# Altium project LUMOS.PrjPcb
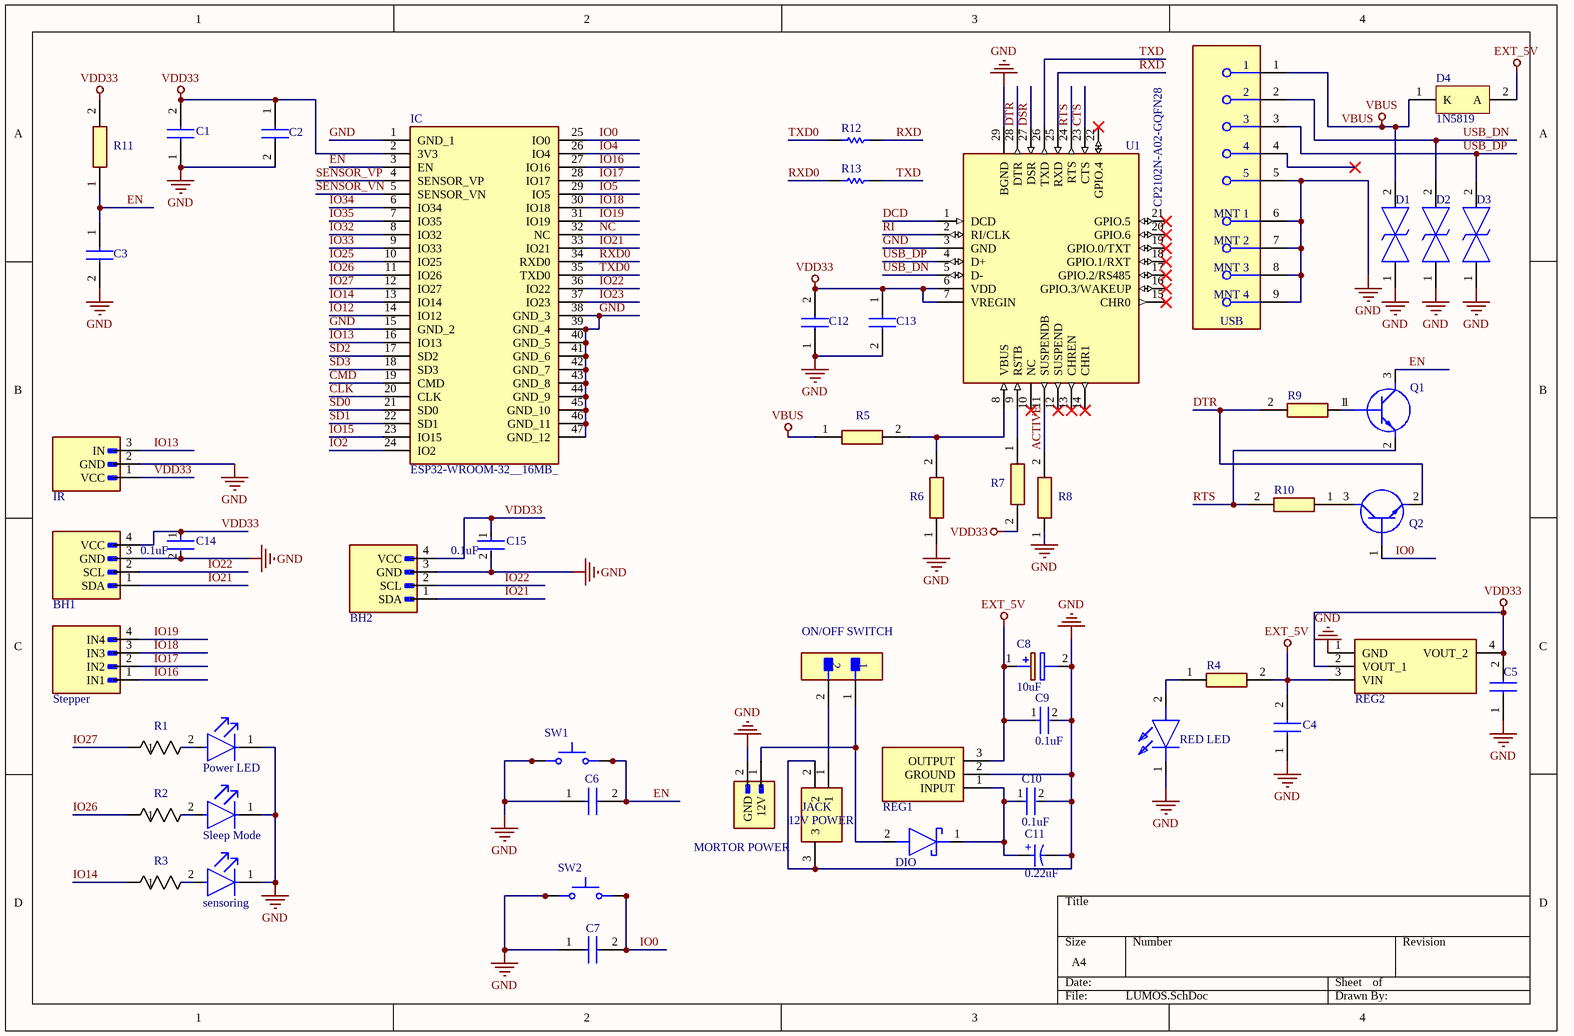
[diagram p0: LUMOS.SchDoc]
1 sheet, 53 parts. Net scope: global (net labels, ports and power ports of the same name join across sheets).
Board file: LUMOS.PcbDoc

## Sheet LUMOS.SchDoc
size A4; SheetNumber: 1; SheetTotal: 1

### Parts
12V_POWER  JACK  [PJ-102AH]
BH1  M20-9990446  [HARWIN_M20-9990446]  (value not drawn)
BH2  M20-9990446  [HARWIN_M20-9990446]  (value not drawn)
C1  22uF/10V(20%)  [FK20]  (value not drawn)
C2  0.1uF/50V(10%)  [C320C104K5R5TA]  (value not drawn)
C3  0.1uF/50V(10%)  [C320C104K5R5TA]  (value not drawn)
C4  22uF/10V(20%)  [FK20]  (value not drawn)
C5  22uF/10V(20%)  [FK20]  (value not drawn)
C6  0.1uF/50V(10%)  [C320C104K5R5TA]  (value not drawn)
C7  0.1uF/50V(10%)  [C320C104K5R5TA]  (value not drawn)
C8  10uF  [CAPPRD200W55D500H1250]
C9  0.1uF  [FP-RDE0P1-MFG]
C10  0.1uF  [FP-RDE0P1-MFG]
C11  0.22uF  [WCAP-ATG8_D5H11]
C12  10uF/10v(20%)  [FK24]  (value not drawn)
C13  0.1uF/50V(10%)  [C320C104K5R5TA]  (value not drawn)
C14  0.1uF  [FP-RDE0P1-MFG]
C15  0.1uF  [FP-RDE0P1-MFG]
D1  LESD5D5.0CT1G  [LESD5D50CT1G]  (value not drawn)
D2  LESD5D5.0CT1G  [LESD5D50CT1G]  (value not drawn)
D3  LESD5D5.0CT1G  [LESD5D50CT1G]  (value not drawn)
D4  1N5819  [ONSC-AXIAL_LEAD-2-59-10_P]
D5  Power LED  [FP-HLMP-1301-MFG]
D6  Sleep Mode  [FP-HLMP-1301-MFG]
D7  sensoring  [FP-HLMP-1301-MFG]
DIO  SD103A-TR  [DIOAD950W60L350D150]  (value not drawn)
IC  ESP32-WROOM-32__16MB_  [ESP32WROOM3216MB]
IR  M20-9990346  [HARWIN_M20-9990346]  (value not drawn)
MORTOR_POWER  M20-9990246  [HARWIN_M20-9990246]  (value not drawn)
ON/OFF_SWITCH  M20-9990246  [FP-M20-9990246-MFG]  (value not drawn)
Q1  SS8050-G  [SOT95P240X115-3N]  (value not drawn)
Q2  SS8050-G  [SOT95P240X115-3N]  (value not drawn)
R1  330ohm  [RES_AC05_VIS]  (value not drawn)
R2  330ohm  [RES_AC05_VIS]  (value not drawn)
R3  330ohm  [RES_AC05_VIS]  (value not drawn)
R4  2k(5%)  [RESAD1590W60L630D240]  (value not drawn)
R5  22.1K(1%)  [RESAD1590W60L630D240]  (value not drawn)
R6  47.5K(1%)  [RESAD1590W60L630D240]  (value not drawn)
R7  2k(5%)  [RESAD1590W60L630D240]  (value not drawn)
R8  10k(5%)(NC)  [RESAD1590W60L630D240]  (value not drawn)
R9  10k(5%)  [RESAD1590W60L630D240]  (value not drawn)
R10  10k(5%)  [RESAD1590W60L630D240]  (value not drawn)
R11  10k(5%)  [RESAD1590W60L630D240]  (value not drawn)
R12  0r(5%)  [RESC2013X60X35ML10T20]  (value not drawn)
R13  0r(5%)  [RESC2013X60X35ML10T20]  (value not drawn)
RED_LED  151031SS06000  [151034GS03000]  (value not drawn)
REG1  L7805CV  [TO255P460X1020X2008-3P]  (value not drawn)
REG2  AMS1117-3.3  [SOT229P700X180-4N]  (value not drawn)
Stepper  M20-9990446  [HARWIN_M20-9990446]  (value not drawn)
SW1  222ADVBA  [SW_222ADVBA]  (value not drawn)
SW2  222ADVBA  [SW_222ADVBA]  (value not drawn)
U1  CP2102N-A02-GQFN28  [QFN50P500X500X80-29N-D]
USB  47642-0001  [FP-47642-0001-MFG]  (value not drawn)

### Nets
EXT_5V: C4.2 C8.1(+) C9.1 D4.2(A) R4.2 REG1.3(OUTPUT) REG2.3(VIN)
GND: 12V_POWER.2 12V_POWER.3 BH1.3(GND) BH2.3(GND) C1.1 C2.2 C3.2 C4.1 C5.1 C6.1 C7.1 C8.2(-) C9.2 C10.2 C11.2(N) C12.1 C13.2 C14.2 C15.2 D1.1 D2.1 D3.1 D5.1(C) D6.1(C) D7.1(C) IC.1(GND_1) IC.15(GND_2) IC.38(GND_3) IC.39(GND_4) IC.40(GND_5) IC.41(GND_6) IC.42(GND_7) IC.43(GND_8) IC.44(GND_9) IC.45(GND_10) IC.46(GND_11) IC.47(GND_12) IR.2(GND) MORTOR_POWER.2(GND) R6.1 R8.1 RED_LED.1(K) REG1.2(GROUND) REG2.1(GND) SW1.1 SW1.3 SW2.1 SW2.3 U1.3(GND) U1.29(BGND) USB.5 USB.6(MNT_1) USB.7(MNT_2) USB.8(MNT_3) USB.9(MNT_4)
VBUS: D1.2 D4.1(K) R5.1 USB.1
VDD33: BH1.4(VCC) BH2.4(VCC) C1.2 C2.1 C5.2 C12.2 C13.1 C14.1 C15.1 IC.2(3V3) IR.1(VCC) R7.2 R11.2 REG2.2(VOUT_1) REG2.4(VOUT_2) U1.6(VDD) U1.7(VREGIN)
ACTIVE: R8.2 U1.11(SUSPENDB)
CLK: IC.20(CLK)
CMD: IC.19(CMD)
CTS: U1.23(CTS)
DCD: U1.1(DCD)
DSR: U1.27(DSR)
DTR: Q2.2(E) R9.2 U1.28(DTR)
EN: C3.1 C6.2 IC.3(EN) Q1.3(C) R11.1 SW1.2 SW1.4
IO0: C7.2 IC.25(IO0) Q2.1(B) SW2.2 SW2.4
IO2: IC.24(IO2)
IO4: IC.26(IO4)
IO5: IC.29(IO5)
IO12: IC.14(IO12)
IO13: IC.16(IO13) IR.3(IN)
IO14: IC.13(IO14) R3.1
IO15: IC.23(IO15)
IO16: IC.27(IO16) Stepper.1(IN1)
IO17: IC.28(IO17) Stepper.2(IN2)
IO18: IC.30(IO18) Stepper.3(IN3)
IO19: IC.31(IO19) Stepper.4(IN4)
IO21: BH1.1(SDA) BH2.1(SDA) IC.33(IO21)
IO22: BH1.2(SCL) BH2.2(SCL) IC.36(IO22)
IO23: IC.37(IO23)
IO25: IC.10(IO25)
IO26: IC.11(IO26) R2.1
IO27: IC.12(IO27) R1.1
IO32: IC.8(IO32)
IO33: IC.9(IO33)
IO34: IC.6(IO34)
IO35: IC.7(IO35)
NC: IC.32(NC)
RI: U1.2(RI/CLK)
RTS: Q1.2(E) R10.2 U1.24(RTS)
RXD: R12.2 U1.25(RXD)
RXD0: IC.34(RXD0) R13.1
SD0: IC.21(SD0)
SD1: IC.22(SD1)
SD2: IC.17(SD2)
SD3: IC.18(SD3)
SENSOR_VN: IC.5(SENSOR_VN)
SENSOR_VP: IC.4(SENSOR_VP)
TXD: R13.2 U1.26(TXD)
TXD0: IC.35(TXD0) R12.1
USB_DN: D2.2 U1.5(D-) USB.2
USB_DP: D3.2 U1.4(D+) USB.3
Net12V_POWER_1: 12V_POWER.1 ON/OFF_SWITCH.2
NetC10_1: C10.1 C11.1(P) DIO.1(K) REG1.1(INPUT)
NetD5_2: D5.2(A) R1.2
NetD6_2: D6.2(A) R2.2
NetD7_2: D7.2(A) R3.2
NetDIO_2: DIO.2(A) MORTOR_POWER.1(12V) ON/OFF_SWITCH.1
NetQ1_1: Q1.1(B) R9.1
NetQ2_3: Q2.3(C) R10.1
NetR4_1: R4.1 RED_LED.2(A)
NetR5_2: R5.2 R6.2 U1.8(VBUS)
NetR7_1: R7.1 U1.9(RSTB)

Not connected (* = marked no-connect by the designer): U1 10(NC)* 12(SUSPEND)* 13(CHREN)* 14(CHR1)* 15(CHR0)* 16(GPIO.3/WAKEUP)* 17(GPIO.2/RS485)* 18(GPIO.1/RXT)* 19(GPIO.0/TXT)* 20(GPIO.6)* 21(GPIO.5)* 22(GPIO.4)*; USB 4*

### Notes on the sheet
- (in symbol CMP-03913-54007281-1) +

### Library data of the parts
12V_POWER = PJ-102A: Connector; Manufacturer_Name: Same Sky; Datasheet Link: https://www.sameskydevices.com/product/resource/supplyframepdf/pj-102a.pdf; Manufacturer_Part_Number: PJ-102A; Mouser Part Number: 490-PJ-102A; Mouser Price/Stock: https://www.mouser.co.uk/ProductDetail/Same-Sky/PJ-102A?qs=WyjlAZoYn50UKjtnxOz%252Bqg%3D%3D; Arrow Part Number: PJ-102A; Arrow Price/Stock: https://www.arrow.com/en/products/pj-102a/cui-devices?utm_currency=USD&region=nac
BH1 BH2 Stepper = M20-9990446: MF: Harwin; Package: None; Price: None; Value: *; MP: M20-9990446; Availability: Unavailable
C1 C4 C5 = FK20X7R1A226MR000: Capacitor; Manufacturer_Name: TDK; Datasheet Link: https://product.tdk.com/system/files/dam/doc/product/capacitor/ceramic/lead-mlcc/catalog/leadmlcc_conventional_fk_en.pdf; Height: 7mm; Manufacturer_Part_Number: FK20X7R1A226MR000; Mouser Part Number: N/A; Mouser Price/Stock: https://www.mouser.co.uk/ProductDetail/TDK/FK20X7R1A226MR000?qs=Ii670aiJhr4gDy7w7zqgKQ%3D%3D
C2 C3 C6 C7 C13 = C320C104K5R5TA: Capacitor; Manufacturer_Name: KEMET; Datasheet Link: https://content.kemet.com/datasheets/KEM_C1050_GOLDMAX_X7R.pdf; Height: 5.84mm; Manufacturer_Part_Number: C320C104K5R5TA; Mouser Part Number: 80-C320C104K5R; Mouser Price/Stock: https://www.mouser.co.uk/ProductDetail/KEMET/C320C104K5R5TA?qs=PmkNt%2FFLxQc4kNUCHU6a6Q%3D%3D; Arrow Part Number: C320C104K5R5TA; Arrow Price/Stock: https://www.arrow.com/en/products/c320c104k5r5ta/kemet-corporation?utm_currency=USD&region=nac
C8 = EEU-FR1H100: Capacitor Polarised,EEU-FR1H100; Manufacturer_Name: Panasonic; Datasheet Link: http://industrial.panasonic.com/cdbs/www-data/pdf/RDF0000/ABA0000C1259.pdf; Height: 12.5mm; Manufacturer_Part_Number: EEU-FR1H100; Mouser Part Number: 667-EEU-FR1H100; Mouser Price/Stock: https://www.mouser.co.uk/ProductDetail/Panasonic/EEU-FR1H100?qs=tfZGHB2PWd1NAbdNSgjToQ%3D%3D
C9 C10 C14 C15 = CMP-06035-036375-1: Ceramic Capacitor 100nF ±10% 25V X7R Radial,RDER71E104K0P1H03B; Lead Diameter: 0.5mm; Mount: Through Hole; Resistor Type: Ceramic; Case/Package: Radial; Height - Seated (Max): 0.236inch; Lead Pitch: 0.098inch; Lead Free: Lead Free; Voltage Rating (DC): 25V; Width: 0.098inch; Packaging: Bulk; Dielectric: X7R; Tolerance: 10%; Min Operating Temperature: -55°C; Capacitance: 100nF; Max Operating Temperature: 125°C; Termination: Radial; Height: 3.5mm; Package Quantity: 500; Voltage Rating: 25V; Length: 0.197inch; Value: 100nF
C11 = CMP-03913-54007281-1: 860010772002 WCAP-ATG8 Aluminum Electrolytic Capacitors; Polarity: Polar; Voltage Rating: 63V; Dissipation Factor: 9%; Tolerance: 20%; Capacitance: 220nF; Leakage Current: 3µA; Pitch: 2mm; Life (Hours): 2000hours; Ripple Current: 4mA; Value: 220nF; Diameter: 5mm; NexarPartId: 54007281; RoHS: Compliant; Lead Pitch: 2.0066mm; Min Operating Temperature: -40°C; Max Operating Temperature: 85°C; Case/Package: Radial; Height - Seated (Max): 12.4968mm; Mount: Through Hole; Height: 11mm; REACH SVHC: Unknown; Voltage Rating (DC): 63V; Length: 11mm; Packaging: Tape & Box (TB)
C12 = FK24X5R1A106KR000: Capacitor; Manufacturer_Name: TDK; Datasheet Link: https://product.tdk.com/system/files/dam/doc/product/capacitor/ceramic/lead-mlcc/catalog/leadmlcc_conventional_fk_en.pdf; Height: 5.5mm; Manufacturer_Part_Number: FK24X5R1A106KR000
D1-D3 = LESD5D5.0CT1G: TVS Diode (Bi-directional); Manufacturer_Name: LRC; Height: 0.7mm; Manufacturer_Part_Number: LESD5D5.0CT1G
D4 = CMP-1055-00042-1: Rectifier, 2-Pin Axial_Lead, Pb-Free, Bulk Bag; Manufacturer: On Semiconductor; IFSM Max (A): 25; Configuration: Single; Note1: 0; PackageDescription: 2-Pin, Axial Lead, Diameter 2.35 mm; Mounting Technology: Through Hole; Packing: Bulk Bag; RoHS: TRUE; DatasheetVersion: Rev. 10; ComponentLink3Description: Package Specification; ComponentLink1URL: http://www.onsemi.com/; ComponentLink2Description: Datasheet; PackageReference: AXIAL_LEAD-2-59-10; ComponentLink3URL: http://www.onsemi.cn/pub_link/Collateral/59-10.PDF; PackageVersion: Rev. U, 02/2005; PartNumber: 1N5819; ComponentLink1Description: Manufacturer URL; ComponentLink2URL: http://www.onsemi.cn/pub_link/Collateral/1N5817-D.PDF
D5-D7 = CMP-18399-000007-1: LED RED DIFFUSED T-1 T/H; Manufacturer: Broadcom; Forward Current: 10mA; Max Junction Temp: +110°C; Wavelength: 626nm; Led Orientation: Straight; Viewing Angle: 60°; Luminous Intensity: 3.4mcd; Forward Voltage: 1.9V; Reverse Voltage: 5V; Peak Emmision Wavelength: 635nm; Mouser Description: Standard LEDs - Through Hole Red Diffused 635nm 3.4mcd; RoHS: TRUE; ComponentLink2Description: Datasheet; Device Class L1: Optoelectronics; Temperature Range High: +100°C; Manufacturer Part Number: HLMP-1301; ComponentLink2URL: https://docs.broadcom.com/docs/AV02-1555EN; Colour: Red; Digikey Description: LED RED DIFFUSED T-1 T/H; Automotive: No; Device Class L2: LEDs; Temperature Range Low: -40°C; Octopart: https://octopart.com/hlmp-1301-broadcom-71130345; Category: Diode; Lead Free: Yes; Device Class L3: unset; Package: 0; Temperature: -40°C to +100°C
DIO = SD103A-TR: Schottky Diode; Manufacturer_Name: Vishay; Datasheet Link: https://componentsearchengine.com/Datasheets/5/SD103A-TR.pdf; Manufacturer_Part_Number: SD103A-TR; Mouser Part Number: 625-SD103A; Mouser Price/Stock: https://www.mouser.co.uk/ProductDetail/Vishay-Semiconductors/SD103A-TR?qs=RwahMLkpD2urFD%2FzZdGOBw%3D%3D; Arrow Part Number: SD103A-TR; Arrow Price/Stock: https://www.arrow.com/en/products/sd103a-tr/vishay?utm_currency=USD&region=nac
IC = ESP32-WROOM-32__16MB_: Integrated Circuit; Manufacturer_Name: Espressif Systems; Manufacturer_Part_Number: ESP32-WROOM-32 (16MB); Datasheet Link: https://www.espressif.com/sites/default/files/documentation/esp32_datasheet_en.pdf; Height: 3.2mm; Mouser Part Number: 356-ESPWROOM3216MB; Mouser Price/Stock: https://www.mouser.co.uk/ProductDetail/Espressif-Systems/ESP32-WROOM-32-16MB?qs=w%2Fv1CP2dgqrcPyEPuQvO1A%3D%3D
IR = M20-9990346: 2.54mm (0.1) Pitch SIL Vertical Throughboard Pin Header, 6.1mm mating pin height, tin, 3 contacts; MF: Harwin; SnapEDA_Link: https://www.snapeda.com/parts/M20-9990346/Harwin/view-part/?ref=snap; Package: None; Value: *; MP: M20-9990346; Check_prices: https://www.snapeda.com/parts/M20-9990346/Harwin/view-part/?ref=eda
MORTOR_POWER = M20-9990246: 2.54mm (0.1) Pitch SIL Vertical Throughboard Pin Header, 6.1mm mating pin height, tin, 2 contacts; MF: Harwin; SnapEDA_Link: https://www.snapeda.com/parts/M20-9990246/Harwin/view-part/?ref=snap; Package: None; Value: *; MP: M20-9990246; Check_prices: https://www.snapeda.com/parts/M20-9990246/Harwin/view-part/?ref=eda
ON/OFF_SWITCH = CMP-15831-000009-1: CONN HEADER VERT 2POS 2.54MM; Manufacturer: Harwin; Conn Gender: Male; Conn Orientation: Vertical; Number Of Contacts: 2; Current Rating: 3A; ComponentLink2URL: https://cdn.harwin.com/pdfs/M20-999.pdf; ComponentLink2Description: Datasheet; Package: M20-9990246; Temperature: -40°C to +105°C; Octopart: https://octopart.com/m20-9990246-harwin-2590635; Mouser Description: 2.54mm (0.1") Pitch SIL Vertical PC Tail Pin Header, 6.1mm mating pin height, tin, 2 contacts; Temperature Range High: +105°C; Device Class L1: Connectors; RoHS: TRUE; Automotive: No; Height: 8.99mm; Number Of Rows: 1; Contact Material: Tin,Nickel; Category: Conn; Pitch: 2.54mm; Lead Free: Yes; Digikey Description: CONN HEADER VERT 2POS 2.54MM; Manufacturer Part Number: M20-9990246; Temperature Range Low: -40°C; Device Class L3: unset; Device Class L2: Headers and Wire Housings
Q1 Q2 = SS8050-G: Transistor BJT NPN; Manufacturer_Name: Comchip Technology; Datasheet Link: https://datasheet.datasheetarchive.com/originals/distributors/DKDS-12/229454.pdf; Height: 1.15mm; Manufacturer_Part_Number: SS8050-G; Mouser Part Number: 750-SS8050-G; Mouser Price/Stock: https://www.mouser.co.uk/ProductDetail/Comchip-Technology/SS8050-G?qs=LLUE9lz1YbcHg%252BWLMAtcrQ%3D%3D; Arrow Part Number: SS8050-G; Arrow Price/Stock: https://www.arrow.com/en/products/ss8050-g/comchip-technology?region=nac
R1-R3 = CMP-00030-39745953-1: AC05000003300JAC00 VISHAY AC05000003300JAC00 Through Hole Resistor, 330 ohm, Axial Leaded, 5 W, 5%, AC Series; Temperature Coefficient: -10ppm/°C; Resistance: 330Ω; Voltage Rating (DC): 40V; Lead Diameter: 800µm; Power Rating: 5W; Value: 330Ω; Lead Free: Lead Free; NexarPartId: 39745953; REACH SVHC: Unknown; Max Operating Temperature: 275°C; Composition: Wirewound; Diameter: 7.5mm; Features: Flame Retardant Coating; Military Standard: Not; Tolerance: 5%; Packaging: Cut Tape (CT); Width: 7.49mm; Number of Terminations: 2; Contact Plating: Tin; Termination: Axial; RoHS: Compliant; Radiation Hardening: No; Min Operating Temperature: -40°C; Length: 18mm; Number of Pins: 2; Max Power Dissipation: 5W; Case/Package: Axial; Schedule B: 8533210080, 8533210080
R4 R7 = CFR-25JB-52-2K2: Resistor; Manufacturer_Name: YAGEO; Datasheet Link: https://www.mouser.in/datasheet/2/447/YAGEO_CFR_datasheet_2021v0-3002993.pdf; Manufacturer_Part_Number: CFR-25JB-52-2K2; Mouser Part Number: 603-CFR-25JB-52-2K2; Mouser Price/Stock: https://www.mouser.co.uk/ProductDetail/YAGEO/CFR-25JB-52-2K2?qs=oypCK0zG327VTyS4ZTRfWw%3D%3D
R5 = MFR-25FRF52-22K1: Resistor; Manufacturer_Name: KEMET; Datasheet Link: https://www.yageo.com/upload/media/product/productsearch/datasheet/lr/YAGEO%20MFR_datasheet_2021v1.pdf; Manufacturer_Part_Number: MFR-25FRF52-22K1; Mouser Part Number: 603-MFR-25FRF5222K1; Mouser Price/Stock: https://www.mouser.co.uk/ProductDetail/YAGEO/MFR-25FRF52-22K1?qs=5furm%2FeQHzR7C102KsI%252BDQ%3D%3D
R6 = MFR-25FBF52-47K5: Resistor; Manufacturer_Name: KEMET; Datasheet Link: https://www.yageo.com/upload/media/product/productsearch/datasheet/lr/YAGEO%20MFR_datasheet_2021v1.pdf; Manufacturer_Part_Number: MFR-25FBF52-47K5; Mouser Part Number: 603-MFR-25FBF52-47K5; Mouser Price/Stock: https://www.mouser.com/Search/Refine.aspx?Keyword=603-MFR-25FBF52-47K5; Arrow Part Number: MFR-25FBF52-47K5; Arrow Price/Stock: https://www.arrow.com/en/products/mfr-25fbf52-47k5/yageo
R8-R11 = CFR-25JB-52-10K: Resistor; Manufacturer_Name: KEMET; Datasheet Link: https://datasheet.datasheetarchive.com/originals/distributors/Datasheets_SAMA/cf5c7c7b14e59499e9125003e6ee5ce2.pdf; Manufacturer_Part_Number: CFR-25JB-52-10K; Mouser Part Number: 603-CFR-25JB-52-10K; Mouser Price/Stock: https://www.mouser.co.uk/ProductDetail/YAGEO/CFR-25JB-52-10K?qs=oypCK0zG32646UD7yHncYg%3D%3D; Arrow Part Number: CFR-25JB-52-10K; Arrow Price/Stock: https://www.arrow.com/en/products/cfr-25jb-52-10k/yageo
R12 R13 = CMP-2100-03673-1: Chip Resistor, 0 Ohm, Jumper, +/- 5%, 0.125 W, -55 to 155 degC, 0805 (2012 Metric), RoHS, Tape and Reel; Manufacturer: Yageo; Power Rating: 125mW; Resistance: 0mOhm; Voltage Rating (DC): 150V; Temperature Coefficient: 200ppm/degreesC; Value: 0mOhm; Height: 0.5mm; Depth: 1.25mm; Case Code (Imperial): 0805; Lead Free: LeadFree; Military Standard: Not; Package Description: 2-Pin Surface Mounted Device, Body 2 x 1.25 mm; Case Code (Metric): 2012; Composition: ThickFilm; Voltage Rating: 150V; Manufacturer URL: http://www.yageo.com/; Packaging: TapeandReel; Package Reference: 0805; REACH SVHC: Unknown; Tolerance: 5%; Case/Package: 0805; Max Operating Temperature: 155degC; Number of Pins: 2; Min Operating Temperature: -55degC; RoHSCompliant: true; Length: 2mm; Datasheet URL: http://www.yageo.com/NewPortal/yageodocoutput?fileName=/pdf/R-Chip/PYu-RC_Group_51_RoHS_L_5.pdf; Termination: SMD/SMT; Radiation Hardening: No; Width: 1.25mm; Contact Plating: Tin; Datasheet Version: Rev. 5, 10/2016
RED_LED = 151031SS06000: LED; Manufacturer_Name: Wurth Elektronik; Datasheet Link: https://katalog.we-online.de/led/datasheet/151031SS06000.pdf; Manufacturer_Part_Number: 151031SS06000; Mouser Part Number: 710-151031SS06000; Mouser Price/Stock: https://www.mouser.co.uk/ProductDetail/Wurth-Elektronik/151031SS06000?qs=LlUlMxKIyB2I%252BOeI1q4%2Fyg%3D%3D
REG1 = L7805CV: Integrated Circuit; Manufacturer_Name: STMicroelectronics; Datasheet Link: http://www.st.com/web/en/resource/technical/document/datasheet/CD00000444.pdf; Height: 4.6mm; Manufacturer_Part_Number: L7805CV; Mouser Part Number: 511-L7805CV; Mouser Price/Stock: https://www.mouser.co.uk/ProductDetail/STMicroelectronics/L7805CV?qs=9NrABl3fj%2FqplZAHiYUxWg%3D%3D; Arrow Part Number: L7805CV; Arrow Price/Stock: https://www.arrow.com/en/products/l7805cv/stmicroelectronics?utm_currency=USD&region=europe
REG2 = AMS1117-3.3: Integrated Circuit; Manufacturer_Name: Advanced Monolithic Systems; Datasheet Link: http://www.advanced-monolithic.com/pdf/ds1117.pdf; Height: 1.8mm; Manufacturer_Part_Number: AMS1117-3.3
SW1 SW2 = 222ADVBA: Tactile Switch SPST-NO Top Actuated Through Hole; MF: CTS Electrocomponents; Price: None; Availability: Unavailable; Package: None; SnapEDA_Link: https://www.snapeda.com/parts/222ADVBA/CTS%20Electrocomponents/view-part/3601198/?ref=snap; MP: 222ADVBA; Value: *
U1 = CP2102N-A02-GQFN28: Integrated Circuit; Manufacturer_Name: Silicon Labs; Datasheet Link: https://componentsearchengine.com/Datasheets/2/CP2102N-A02-GQFN28.pdf; Height: 0.8mm; Manufacturer_Part_Number: CP2102N-A02-GQFN28; Mouser Part Number: 634-CP2102NA02GQFN28; Mouser Price/Stock: https://www.mouser.co.uk/ProductDetail/Silicon-Labs/CP2102N-A02-GQFN28?qs=u16ybLDytRaSBkSkyjYFiA%3D%3D; Arrow Part Number: CP2102N-A02-GQFN28; Arrow Price/Stock: https://www.arrow.com/en/products/cp2102n-a02-gqfn28/silicon-labs?utm_currency=USD&region=europe
USB = CMP-04767-000010-1: CONN RCPT MICRO USB B 5POS SMD; Pitch: 0.65mm; Number of Ports: 1; Voltage Rating (AC): 30V; Gender: Female; Number of Circuits: 5; USB Standard: USB 2.0; Current Rating: 1.8A; Contact Plating: Gold; Package Quantity: 1500; Mount: Surface Mount; RoHS Compliant: Yes; Max Operating Temperature: 85°C; Length: 10.2mm; Housing Material: Polymer; Termination: Solder; Number of Terminals/Pins: 5; Number of Contacts: 5; Packaging: Tape and Reel; Connector Type: USB; Orientation: Right Angle; Contact Material: Copper Alloy; Voltage Rating: 30V; Halogen Free: Low Halogen; Min Operating Temperature: -30°C; Radiation Hardening: No; Series: 47642